# Altium project RP2040.PrjPcb
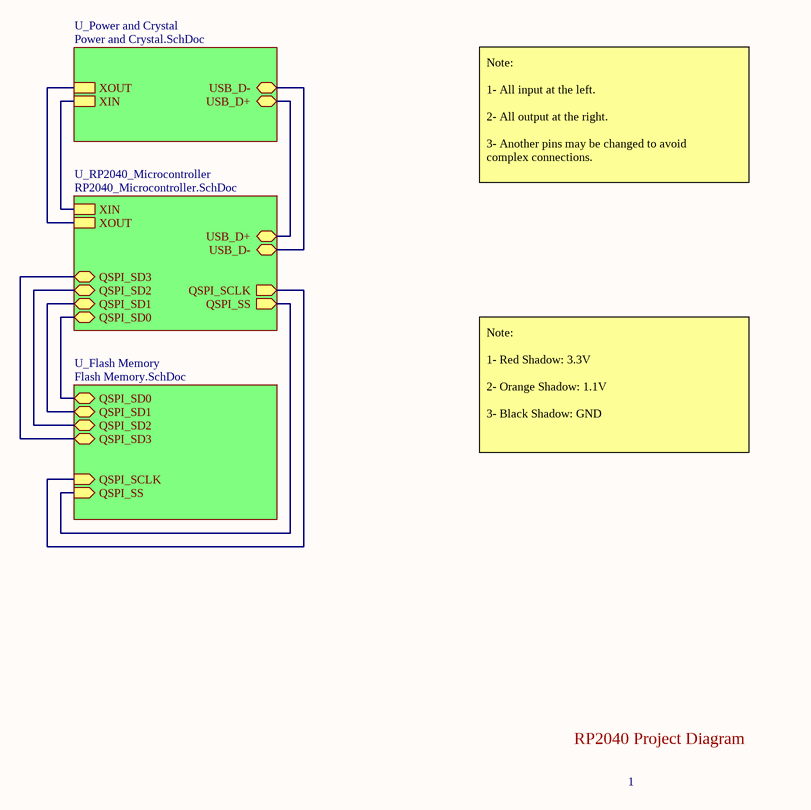
[diagram p0: Project Diagram.SchDoc]
Designer: Abdelrhman Khaled
4 sheets, 30 parts. Net scope: hierarchical (ports join the sheet entries above them; power ports are global).
Board file: RP2040_PCB.PcbDoc
Sheets:
  Project Diagram.SchDoc
    U_RP2040_Microcontroller = RP2040_Microcontroller.SchDoc
    U_Power and Crystal = Power and Crystal.SchDoc
    U_Flash Memory = Flash Memory.SchDoc

## Sheet Project Diagram.SchDoc
size A; SheetNumber: 1; SheetTotal: 4

### Sub-sheets
U_Flash Memory = Flash Memory.SchDoc: QSPI_SD0 (bidir), QSPI_SD1 (bidir), QSPI_SD2 (bidir), QSPI_SD3 (bidir), QSPI_SCLK (in), QSPI_SS (in)
U_Power and Crystal = Power and Crystal.SchDoc: XIN, XOUT, USB_D+ (bidir), USB_D- (bidir)
U_RP2040_Microcontroller = RP2040_Microcontroller.SchDoc: USB_D+ (bidir), USB_D- (bidir), QSPI_SS (out), QSPI_SD0 (bidir), QSPI_SD1 (bidir), QSPI_SD2 (bidir), QSPI_SD3 (bidir), QSPI_SCLK (out), XIN, XOUT

### Nets
QSPI_SCLK: sheet U_RP2040_Microcontroller/QSPI_SCLK, sheet U_Flash Memory/QSPI_SCLK
QSPI_SD0: sheet U_RP2040_Microcontroller/QSPI_SD0, sheet U_Flash Memory/QSPI_SD0
QSPI_SD1: sheet U_RP2040_Microcontroller/QSPI_SD1, sheet U_Flash Memory/QSPI_SD1
QSPI_SD2: sheet U_RP2040_Microcontroller/QSPI_SD2, sheet U_Flash Memory/QSPI_SD2
QSPI_SD3: sheet U_RP2040_Microcontroller/QSPI_SD3, sheet U_Flash Memory/QSPI_SD3
QSPI_SS: sheet U_RP2040_Microcontroller/QSPI_SS, sheet U_Flash Memory/QSPI_SS
USB_N: sheet U_RP2040_Microcontroller/USB_D-, sheet U_Power and Crystal/USB_D-
USB_P: sheet U_RP2040_Microcontroller/USB_D+, sheet U_Power and Crystal/USB_D+
XIN: sheet U_RP2040_Microcontroller/XIN, sheet U_Power and Crystal/XIN
XOUT: sheet U_RP2040_Microcontroller/XOUT, sheet U_Power and Crystal/XOUT

### Notes on the sheet
- Note:
  1- All input at the left.
  2- All output at the right.
  3- Another pins may be changed to avoid     complex connections.
- Note:
  1- Red Shadow: 3.3V
  2- Orange Shadow: 1.1V
  3- Black Shadow: GND
- RP2040 Project Diagram
- 1

## Sheet RP2040_Microcontroller.SchDoc
size B; SheetNumber: 2; SheetTotal: 4
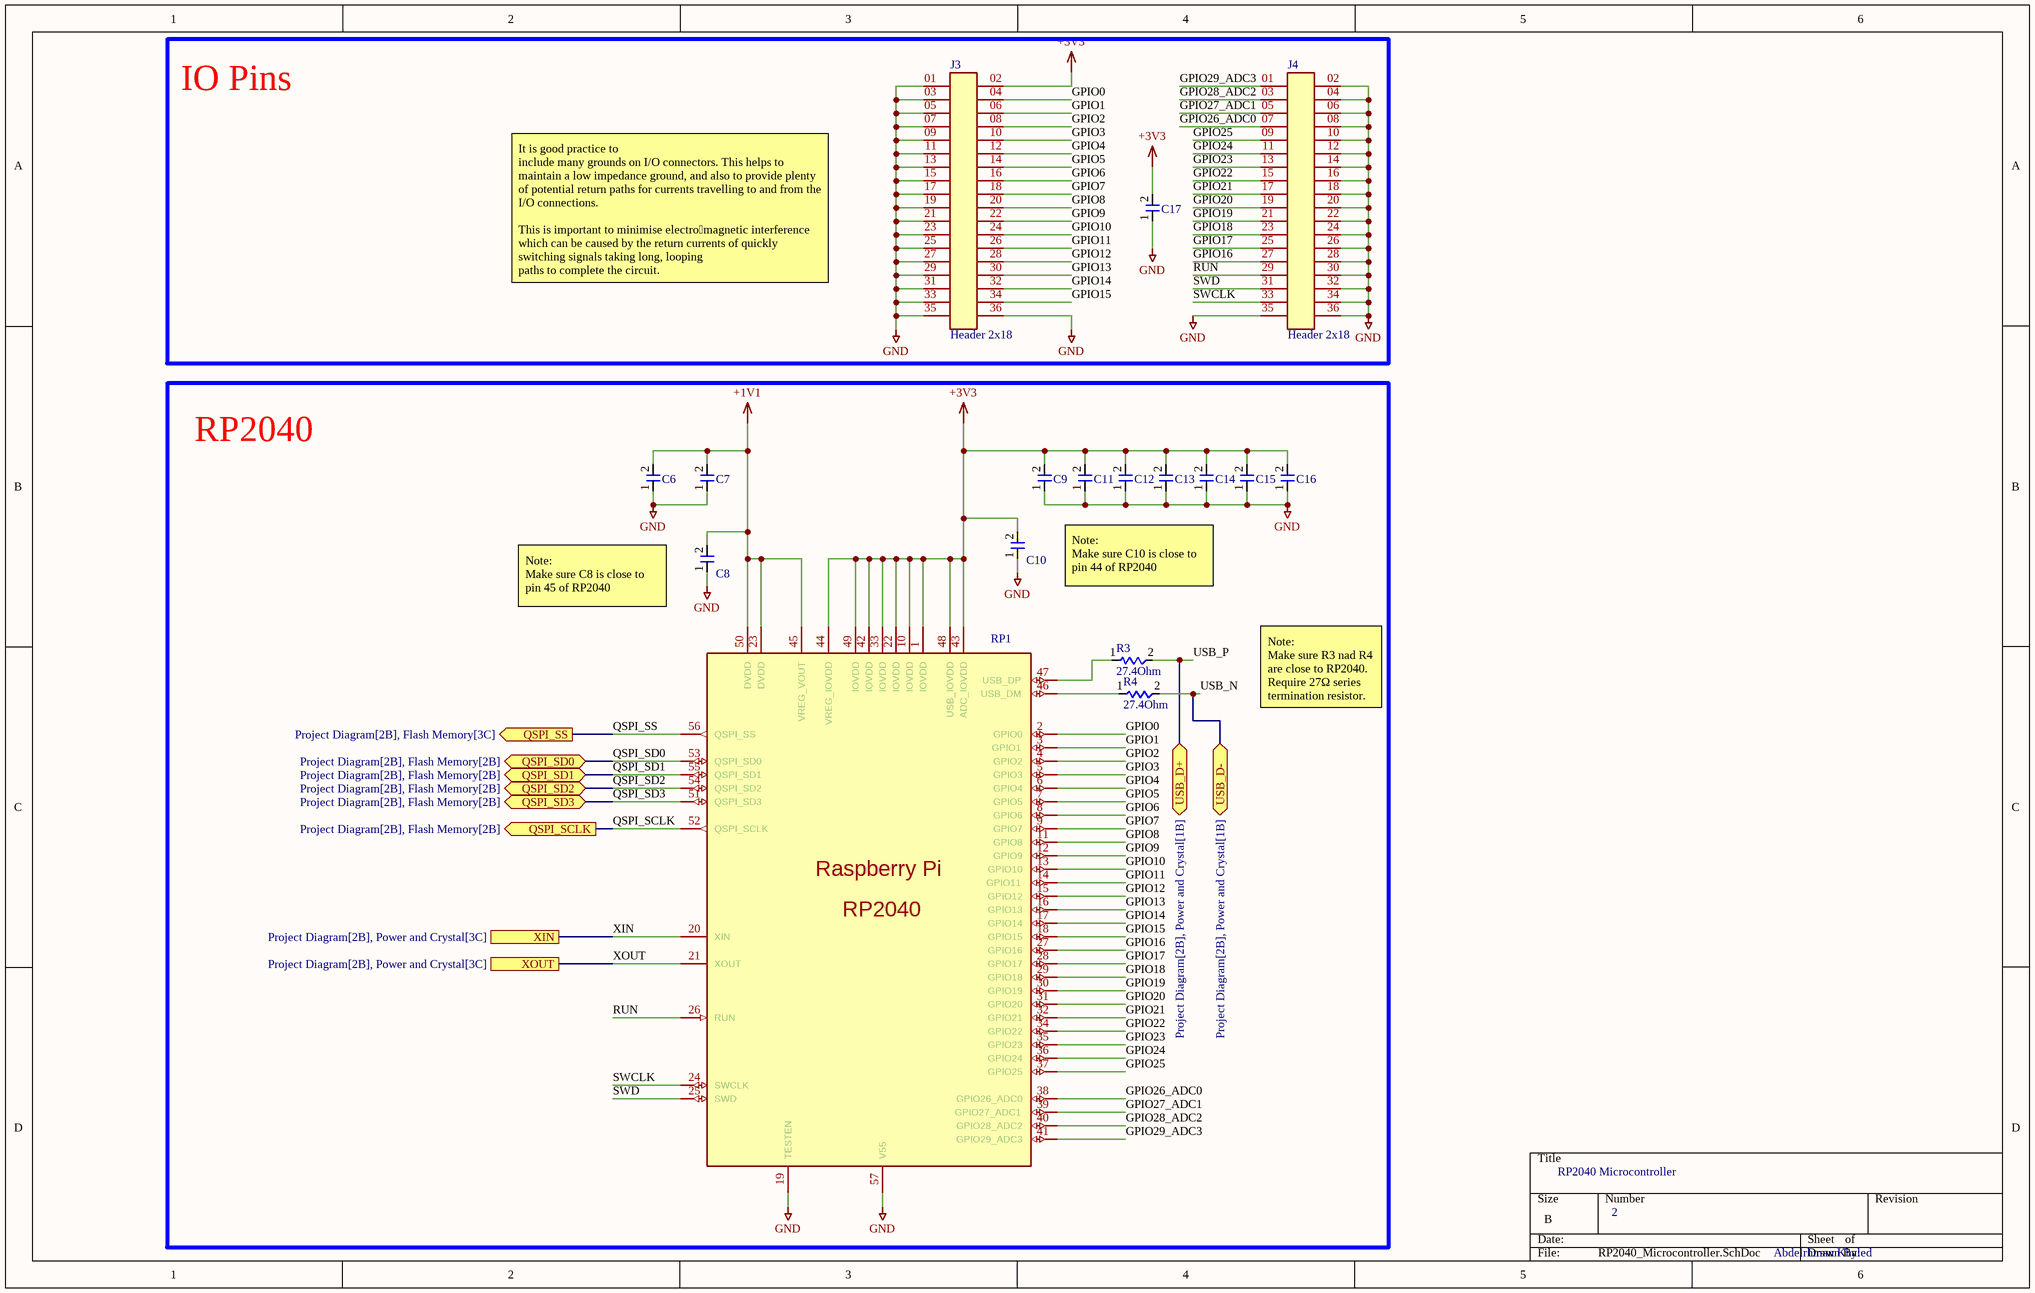
[diagram p1: RP2040_Microcontroller.SchDoc]

### Parts
C6  100 nF  [CC0603KRX5R8BB104]  (value not drawn)
C7  100 nF  [CC0603KRX5R8BB104]  (value not drawn)
C8  1UF Cap  [C0805C105K4RAC7800]  (value not drawn)
C9  100 nF  [CC0603KRX5R8BB104]  (value not drawn)
C10  1UF Cap  [C0805C105K4RAC7800]  (value not drawn)
C11  100 nF  [CC0603KRX5R8BB104]  (value not drawn)
C12  100 nF  [CC0603KRX5R8BB104]  (value not drawn)
C13  100 nF  [CC0603KRX5R8BB104]  (value not drawn)
C14  100 nF  [CC0603KRX5R8BB104]  (value not drawn)
C15  100 nF  [CC0603KRX5R8BB104]  (value not drawn)
C16  100 nF  [CC0603KRX5R8BB104]  (value not drawn)
C17  10UF Capacitor  [CL21A106KOQNNNE - duplicate]  (value not drawn)
J3  Header 2x18  [Header 2x18]
J4  Header 2x18  [Header 2x18]
R3  27.4Ohm  [RC1206FR-078K06L]
R4  27.4Ohm  [RC1206FR-078K06L]
RP1  CortexM0  [RaspberryPI2040]  (value not drawn)

### Blocks framed on the sheet
IO Pins: C17 J3 J4
RP2040: C6-C16 R3 R4 RP1

### Ports
QSPI_SCLK (out, see Project Diagram[2B], Flash Memory[2B]), QSPI_SD0 (bidir, see Project Diagram[2B], Flash Memory[2B]), QSPI_SD1 (bidir, see Project Diagram[2B], Flash Memory[2B]), QSPI_SD2 (bidir, see Project Diagram[2B], Flash Memory[2B]), QSPI_SD3 (bidir, see Project Diagram[2B], Flash Memory[2B]), QSPI_SS (out, see Project Diagram[2B], Flash Memory[3C]), USB_D+ (bidir, see Project Diagram[2B], Power and Crystal[1B]), USB_D- (bidir, see Project Diagram[2B], Power and Crystal[1B]), XIN (see Project Diagram[2B], Power and Crystal[3C]), XOUT (see Project Diagram[2B], Power and Crystal[3C])

### Nets
+1V1: C6.2(Pin_2) C7.2(Pin_2) C8.2(Pin_2) RP1.23(DVDD) RP1.45(VREG_VOUT) RP1.50(DVDD)
+3V3: C9.2(Pin_2) C10.2(Pin_2) C11.2(Pin_2) C12.2(Pin_2) C13.2(Pin_2) C14.2(Pin_2) C15.2(Pin_2) C16.2(Pin_2) C17.2(Pin_2) J3.02 RP1.1(IOVDD) RP1.10(IOVDD) RP1.22(IOVDD) RP1.33(IOVDD) RP1.42(IOVDD) RP1.43(ADC_IOVDD) RP1.44(VREG_IOVDD) RP1.48(USB_IOVDD) RP1.49(IOVDD)
GND: C6.1(Pin_1) C7.1(Pin_1) C8.1(Pin_1) C9.1(Pin_1) C10.1(Pin_1) C11.1(Pin_1) C12.1(Pin_1) C13.1(Pin_1) C14.1(Pin_1) C15.1(Pin_1) C16.1(Pin_1) C17.1(Pin_1) J3.01 J3.03 J3.05 J3.07 J3.09 J3.11 J3.13 J3.15 J3.17 J3.19 J3.21 J3.23 J3.25 J3.27 J3.29 J3.31 J3.33 J3.35 J3.36 J4.02 J4.04 J4.06 J4.08 J4.10 J4.12 J4.14 J4.16 J4.18 J4.20 J4.22 J4.24 J4.26 J4.28 J4.30 J4.32 J4.34 J4.35 J4.36 RP1.19(TESTEN) RP1.57(V55)
GPIO0: J3.04 RP1.2(GPIO0)
GPIO1: J3.06 RP1.3(GPIO1)
GPIO2: J3.08 RP1.4(GPIO2)
GPIO3: J3.10 RP1.5(GPIO3)
GPIO4: J3.12 RP1.6(GPIO4)
GPIO5: J3.14 RP1.7(GPIO5)
GPIO6: J3.16 RP1.8(GPIO6)
GPIO7: J3.18 RP1.9(GPIO7)
GPIO8: J3.20 RP1.11(GPIO8)
GPIO9: J3.22 RP1.12(GPIO9)
GPIO10: J3.24 RP1.13(GPIO10)
GPIO11: J3.26 RP1.14(GPIO11)
GPIO12: J3.28 RP1.15(GPIO12)
GPIO13: J3.30 RP1.16(GPIO13)
GPIO14: J3.32 RP1.17(GPIO14)
GPIO15: J3.34 RP1.18(GPIO15)
GPIO16: J4.27 RP1.27(GPIO16)
GPIO17: J4.25 RP1.28(GPIO17)
GPIO18: J4.23 RP1.29(GPIO18)
GPIO19: J4.21 RP1.30(GPIO19)
GPIO20: J4.19 RP1.31(GPIO20)
GPIO21: J4.17 RP1.32(GPIO21)
GPIO22: J4.15 RP1.34(GPIO22)
GPIO23: J4.13 RP1.35(GPIO23)
GPIO24: J4.11 RP1.36(GPIO24)
GPIO25: J4.09 RP1.37(GPIO25)
GPIO26_ADC0: J4.07 RP1.38(GPIO26_ADC0)
GPIO27_ADC1: J4.05 RP1.39(GPIO27_ADC1)
GPIO28_ADC2: J4.03 RP1.40(GPIO28_ADC2)
GPIO29_ADC3: J4.01 RP1.41(GPIO29_ADC3)
QSPI_SCLK: RP1.52(QSPI_SCLK) ; port QSPI_SCLK
QSPI_SD0: RP1.53(QSPI_SD0) ; port QSPI_SD0
QSPI_SD1: RP1.55(QSPI_SD1) ; port QSPI_SD1
QSPI_SD2: RP1.54(QSPI_SD2) ; port QSPI_SD2
QSPI_SD3: RP1.51(QSPI_SD3) ; port QSPI_SD3
QSPI_SS: RP1.56(QSPI_SS) ; port QSPI_SS
RUN: J4.29 RP1.26(RUN)
SWCLK: J4.33 RP1.24(SWCLK)
SWD: J4.31 RP1.25(SWD)
USB_N: R4.2(pin_2) ; port USB_D-
USB_P: R3.2(pin_2) ; port USB_D+
XIN: RP1.20(XIN) ; port XIN
XOUT: RP1.21(XOUT) ; port XOUT
NetR3_1: R3.1(Pin_1) RP1.47(USB_DP)
NetR4_1: R4.1(Pin_1) RP1.46(USB_DM)

### Notes on the sheet
- It is good practice to
  include many grounds on I/O connectors. This helps to maintain a low impedance ground, and also to provide plenty of potential return paths for currents travelling to and from the I/O connections.
  This is important to minimise electromagnetic interference which can be caused by the return currents of quickly switching signals taking long, looping
  paths to complete the circuit.
- Note:
  Make sure C8 is close to
  pin 45 of RP2040
- Note:
  Make sure C10 is close to
  pin 44 of RP2040
- Note:
  Make sure R3 nad R4 are close to RP2040.                                                         Require 27Ω series termination resistor.
- RP2040 Microcontroller
- (in symbol RaspberryPI2040) Raspberry Pi; RP2040

### Library data of the parts
C6 C7 C9 C11-C16 = CC0603KRX5R8BB104: 100 nF ±10% 25V Ceramic Capacitor X5R 0603 (1608 Metric); Part Number: CL21A106KOQNNNE; Value: 100nF; Link: https://www.digikey.com/en/products/detail/samsung-electro-mechanics/CL21A106KOQNNNE/3886754; Link1: https://www.digikey.com/en/products/detail/yageo/CC0603KRX5R8BB104/20376210?s=N4IgjCBcoEwAwBYCcVQGMoDMCGAbAzgKYA0IA9lANrhxwAEAdgGIgC6pADgC5QgCqDAJZcA8pgCyhbPgCuAJ0IgAvqQC0ANlQgMkLnJklyVEAGYQpGGyUqQlyNTC1GmOmmwdsaYWTlWgA; Parameter 2: *
C8 C10 = C0805C105K4RAC7800: 1 µF ±10% 16V Ceramic Capacitor X7R 0805 (2012 Metric); Part Number: C0805C105K4RAC7800; Link: https://www.digikey.com/en/products/detail/kemet/C0805C105K4RAC7800/416047; Value: 1UF
C17 = CL21A106KOQNNNE: 10 µF ±10% 16V Ceramic Capacitor X5R 0805 (2012 Metric); Part Number: CL21A106KOQNNNE; Link: https://www.digikey.com/en/products/detail/samsung-electro-mechanics/CL21A106KOQNNNE/3886754; Value: 10UF
R3 R4 = RC1206FR-078K06L: 8.06 kOhms ±1% 0.25W, 1/4W Chip Resistor 1206 (3216 Metric) Moisture Resistant Thick Film; Part Number: RC1206FR-078K06L; Link: https://www.digikey.com/en/products/detail/yageo/RC1206FR-078K06L/729108
RP1 = RaspberryPI2040: Microcontrollers connect the world of software to the world of hardware. They allow developers to write software which / interacts with the physical world in the same deterministic, cycle-accurate manner as digital logic. They occupy the / bottom left corner of the price/performance space, outselling their more powerful brethren by a factor of ten to one. / They are the workhorses that power the digital transformation of our world.

## Sheet Power and Crystal.SchDoc
size A; SheetNumber: 3; SheetTotal: 4
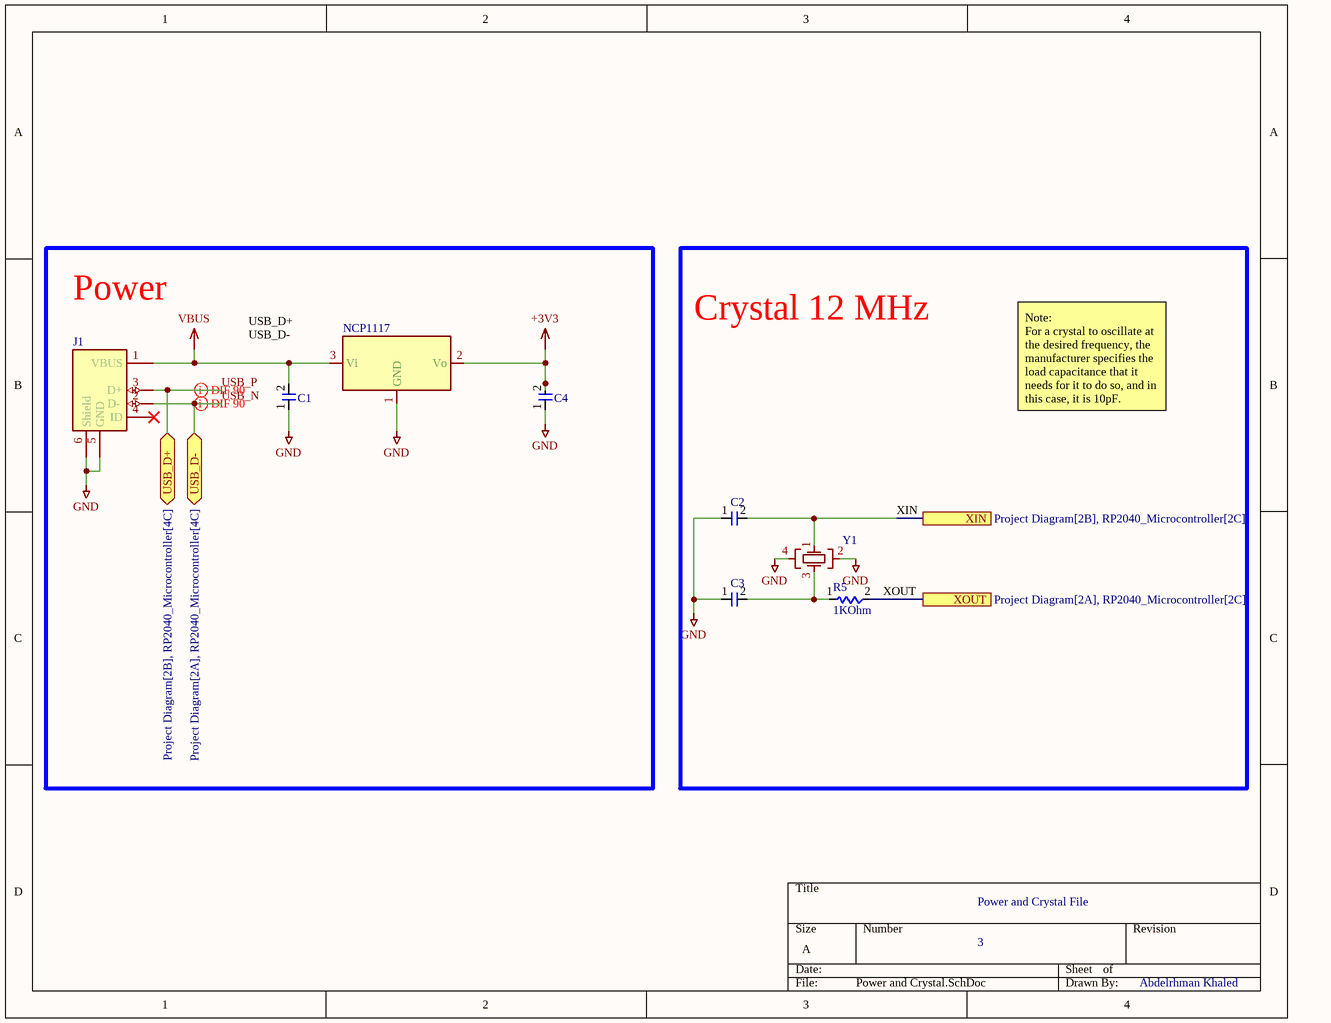
[diagram p2: Power and Crystal.SchDoc]

### Parts
C1  10UF Capacitor  [CL21A106KOQNNNE - duplicate]  (value not drawn)
C2  CAP CER 15PF 50V  [CAP CER 15PF 50V]  (value not drawn)
C3  CAP CER 15PF 50V  [CAP CER 15PF 50V]  (value not drawn)
C4  10UF Capacitor  [CL21A106KOQNNNE - duplicate]  (value not drawn)
J1  USB_B Micro  [USB_B Micro]  (value not drawn)
NCP1117  IC REG LINEAR 3.3V 1A SOT223  [NCP1117LPST33T3G]  (value not drawn)
R5  1KOhm  [RC1206FR-078K06L]
Y1  Crystal 12 MHz  [Crystal 12 MHz]  (value not drawn)

### Blocks framed on the sheet
Power: C1 C4 J1 NCP1117
Crystal 12 MHz: C2 C3 R5 Y1

### Ports
USB_D+ (bidir, see Project Diagram[2B], RP2040_Microcontroller[4C]), USB_D- (bidir, see Project Diagram[2A], RP2040_Microcontroller[4C]), XIN (see Project Diagram[2B], RP2040_Microcontroller[2C]), XOUT (see Project Diagram[2A], RP2040_Microcontroller[2C])

### Nets
+3V3: C4.2(Pin_2) NCP1117.2(Vo)
GND: C1.1(Pin_1) C2.1(Pin_1) C3.1(Pin_1) C4.1(Pin_1) J1.5(GND) J1.6(Shield) NCP1117.1(GND) Y1.2 Y1.4
VBUS: C1.2(Pin_2) J1.1(VBUS) NCP1117.3(Vi)
USB_N: J1.2(D-) ; port USB_D-
USB_P: J1.3(D+) ; port USB_D+
XIN: C2.2(Pin_2) Y1.1 ; port XIN
XOUT: R5.2(pin_2) ; port XOUT
NetC3_2: C3.2(Pin_2) R5.1(Pin_1) Y1.3

Not connected (* = marked no-connect by the designer): J1 4(ID)*

### Layout directives
differential pair; differential pair class DIF 90; net class DIF 90: USB_N, USB_P

### Notes on the sheet
- Note:
  For a crystal to oscillate at the desired frequency, the manufacturer specifies the load capacitance that it needs for it to do so, and in this case, it is 10pF.
- Power and Crystal File
- Labels drawn without touching a wire or pin: USB_D+, USB_D-

### Library data of the parts
C1 C4 = CL21A106KOQNNNE: as C17 on sheet RP2040_Microcontroller; Part Number: CL21A106KOQNNNE; Link: https://www.digikey.com/en/products/detail/samsung-electro-mechanics/CL21A106KOQNNNE/3886754; Value: 10UF
C2 C3 = CAP CER 15PF 50V: 15 pF ±5% 50V Ceramic Capacitor C0G, NP0 0805 (2012 Metric); Part Number: CC0805JRNPO9BN150; Link: https://www.digikey.com/en/products/detail/yageo/CC0805JRNPO9BN150/302835
J1 = USB_B Micro: Conn Data USB Micro B w/Flange SMT Bottom Mnt LF | Molex Incorporated 47346-0001; Part Number: 47346-0001; Link: https://www.snapeda.com/parts/47346-0001/Molex/view-part/
NCP1117 = NCP1117LPST33T3G: Linear Voltage Regulator IC Positive Fixed 1 Output 1A SOT-223; Part Number: NCP1117LPST33T3GOSTR-ND; Link: https://www.digikey.com/en/products/detail/onsemi/NCP1117LPST33T3G/2194024
R5 = RC1206FR-078K06L: as R3 on sheet RP2040_Microcontroller; Part Number: RC1206FR-078K06L; Link: https://www.digikey.com/en/products/detail/yageo/RC1206FR-078K06L/729108
Y1 = Crystal 12 MHz: 12 MHz ±30ppm Crystal 18pF 150 Ohms 4-SMD, No Lead; Part Number: 403C35D12M00000; Link: https://www.digikey.com/en/products/detail/cts-frequency-controls/403C35D12M00000/2292747

## Sheet Flash Memory.SchDoc
size A; SheetNumber: 4; SheetTotal: 4
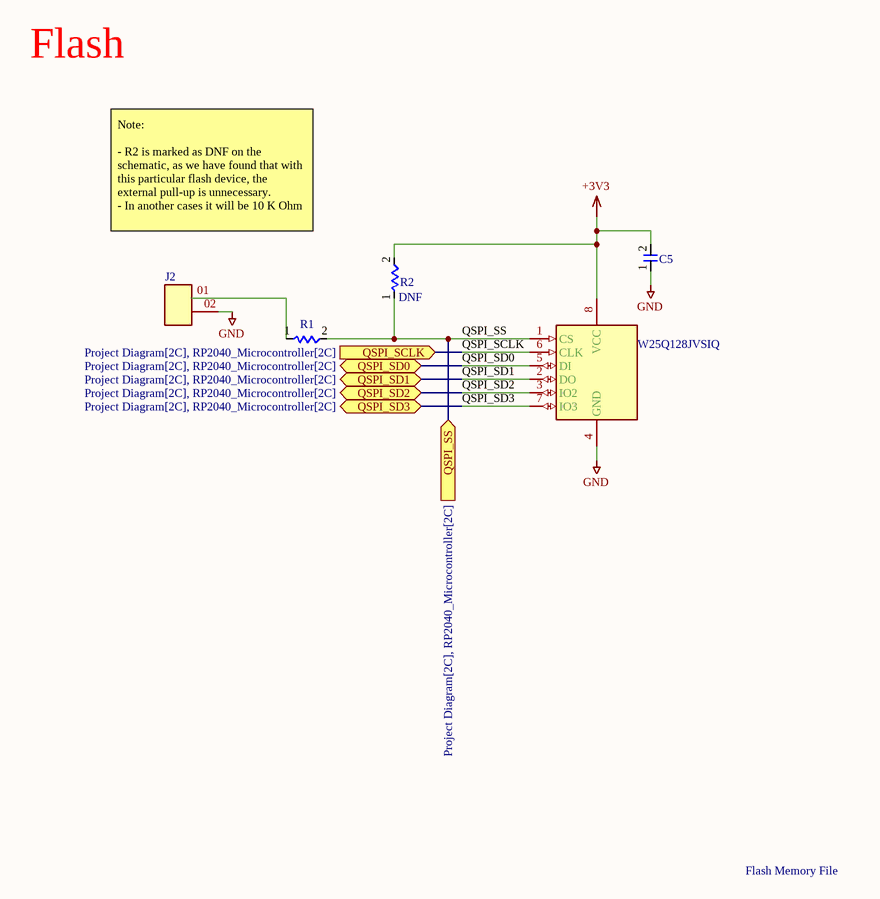
[diagram p3: Flash Memory.SchDoc]

### Parts
C5  10UF Capacitor  [CC0603KRX5R8BB104]  (value not drawn)
J2  Header 1x2  [Header 1x2]  (value not drawn)
R1  1 KOhm  [RC1206FR-078K06L]  (value not drawn)
R2  1 KOhm  [RC1206FR-078K06L]  (value not drawn)
U2  W25Q128JVSIQ  [W25Q128JVSIQ-ND]

### Ports
QSPI_SCLK (in, see Project Diagram[2C], RP2040_Microcontroller[2C]), QSPI_SD0 (bidir, see Project Diagram[2C], RP2040_Microcontroller[2C]), QSPI_SD1 (bidir, see Project Diagram[2C], RP2040_Microcontroller[2C]), QSPI_SD2 (bidir, see Project Diagram[2C], RP2040_Microcontroller[2C]), QSPI_SD3 (bidir, see Project Diagram[2C], RP2040_Microcontroller[2C]), QSPI_SS (in, see Project Diagram[2C], RP2040_Microcontroller[2C])

### Nets
+3V3: C5.2(Pin_2) R2.2(pin_2) U2.8(VCC)
GND: C5.1(Pin_1) J2.02 U2.4(GND)
QSPI_SCLK: U2.6(CLK) ; port QSPI_SCLK
QSPI_SD0: U2.5(DI) ; port QSPI_SD0
QSPI_SD1: U2.2(DO) ; port QSPI_SD1
QSPI_SD2: U2.3(IO2) ; port QSPI_SD2
QSPI_SD3: U2.7(IO3) ; port QSPI_SD3
QSPI_SS: R1.2(pin_2) R2.1(Pin_1) U2.1(CS) ; port QSPI_SS
NetJ2_01: J2.01 R1.1(Pin_1)

### Notes on the sheet
- Flash
- Note:
  - R2 is marked as DNF on the schematic, as we have found that with this particular flash device, the external pull-up is unnecessary.
  - In another cases it will be 10 K Ohm
- (near R2) DNF
- Flash Memory File

### Library data of the parts
C5 = CC0603KRX5R8BB104: as C6 on sheet RP2040_Microcontroller; Link: https://www.digikey.com/en/products/detail/samsung-electro-mechanics/CL21A106KOQNNNE/3886754; Link1: https://www.digikey.com/en/products/detail/yageo/CC0603KRX5R8BB104/20376210?s=N4IgjCBcoEwAwBYCcVQGMoDMCGAbAzgKYA0IA9lANrhxwAEAdgGIgC6pADgC5QgCqDAJZcA8pgCyhbPgCuAJ0IgAvqQC0ANlQgMkLnJklyVEAGYQpGGyUqQlyNTC1GmOmmwdsaYWTlWgA; Parameter 2: *
R1 R2 = RC1206FR-078K06L: as R3 on sheet RP2040_Microcontroller; Part Number: RC1206FR-078K06L; Link: https://www.digikey.com/en/products/detail/yageo/RC1206FR-078K06L/729108
U2 = W25Q128JVSIQ: FLASH - NOR Memory IC 128Mbit SPI - Quad I/O, QPI 133 MHz 8-SOIC; Part Number: W25Q128JVSIQ; Link: https://www.digikey.com/en/products/detail/winbond-electronics/W25Q128JVSIQ/5803943

## Nets that join several sheets
+3V3: RP2040_Microcontroller (19 pins), Power and Crystal (C4.2 NCP1117.2), Flash Memory (C5.2 R2.2 U2.8)
GND: RP2040_Microcontroller (52 pins), Power and Crystal (9 pins), Flash Memory (C5.1 J2.02 U2.4)
QSPI_SCLK: RP2040_Microcontroller (RP1.52), Flash Memory (U2.6)
QSPI_SD0: RP2040_Microcontroller (RP1.53), Flash Memory (U2.5)
QSPI_SD1: RP2040_Microcontroller (RP1.55), Flash Memory (U2.2)
QSPI_SD2: RP2040_Microcontroller (RP1.54), Flash Memory (U2.3)
QSPI_SD3: RP2040_Microcontroller (RP1.51), Flash Memory (U2.7)
QSPI_SS: RP2040_Microcontroller (RP1.56), Flash Memory (R1.2 R2.1 U2.1)
USB_N: RP2040_Microcontroller (R4.2), Power and Crystal (J1.2)
USB_P: RP2040_Microcontroller (R3.2), Power and Crystal (J1.3)
XIN: RP2040_Microcontroller (RP1.20), Power and Crystal (C2.2 Y1.1)
XOUT: RP2040_Microcontroller (RP1.21), Power and Crystal (R5.2)